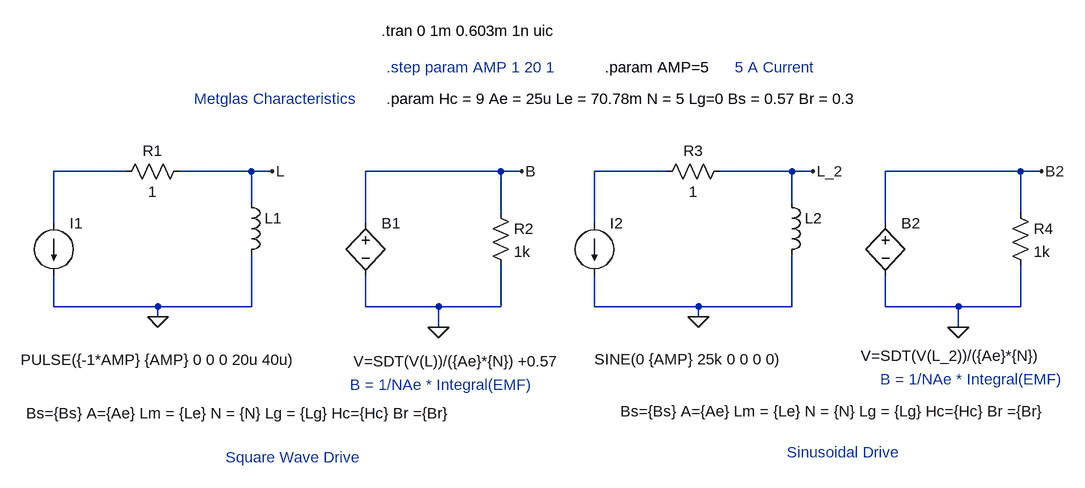
[diagram p0: schematic FULL_LTSPICE.asc]
FULL_LTSPICE.asc, the LTspice schematic file:
Version 4
SHEET 1 2340 832
WIRE 576 16 464 16
WIRE 768 16 656 16
WIRE 800 16 768 16
WIRE 1152 16 944 16
WIRE 1184 16 1152 16
WIRE 1408 16 1296 16
WIRE 1600 16 1488 16
WIRE 1632 16 1600 16
WIRE 1952 16 1744 16
WIRE 1984 16 1952 16
WIRE 768 64 768 16
WIRE 1600 64 1600 16
WIRE 1152 80 1152 16
WIRE 1952 80 1952 16
WIRE 464 96 464 16
WIRE 944 96 944 16
WIRE 1296 96 1296 16
WIRE 1744 96 1744 16
WIRE 464 224 464 176
WIRE 624 224 464 224
WIRE 768 224 768 144
WIRE 768 224 624 224
WIRE 944 224 944 176
WIRE 1056 224 944 224
WIRE 1152 224 1152 160
WIRE 1152 224 1056 224
WIRE 1296 224 1296 176
WIRE 1456 224 1296 224
WIRE 1600 224 1600 144
WIRE 1600 224 1456 224
WIRE 1744 224 1744 176
WIRE 1856 224 1744 224
WIRE 1952 224 1952 160
WIRE 1952 224 1856 224
WIRE 624 240 624 224
WIRE 1456 240 1456 224
WIRE 1056 256 1056 224
WIRE 1856 256 1856 224
FLAG 624 240 0
FLAG 800 16 L
FLAG 1056 256 0
FLAG 1184 16 B
FLAG 1456 240 0
FLAG 1632 16 L_2
FLAG 1856 256 0
FLAG 1984 16 B2
SYMBOL ind 752 48 R0
WINDOW 3 -331 340 Left 2
SYMATTR Value Bs={Bs} A={Ae} Lm = {Le} N = {N} Lg = {Lg} Hc={Hc} Br ={Br}
SYMATTR InstName L1
SYMBOL current 464 96 R0
WINDOW 3 -51 210 Left 2
WINDOW 123 0 0 Left 0
WINDOW 39 0 0 Left 0
SYMATTR Value PULSE({-1*AMP} {AMP} 0 0 0 20u 40u)
SYMATTR InstName I1
SYMBOL res 672 0 R90
WINDOW 0 0 56 VBottom 2
WINDOW 3 32 56 VTop 2
SYMATTR InstName R1
SYMATTR Value 1
SYMBOL bv 944 80 R0
WINDOW 3 -19 228 Left 2
SYMATTR Value V=SDT(V(L))/({Ae}*{N}) +0.57
SYMATTR InstName B1
SYMBOL res 1136 64 R0
SYMATTR InstName R2
SYMATTR Value 1k
SYMBOL ind 1584 48 R0
WINDOW 3 -248 337 Left 2
SYMATTR Value Bs={Bs} A={Ae} Lm = {Le} N = {N} Lg = {Lg} Hc={Hc} Br ={Br}
SYMATTR InstName L2
SYMBOL current 1296 96 R0
WINDOW 3 0 209 Left 2
WINDOW 123 0 0 Left 0
WINDOW 39 0 0 Left 0
SYMATTR Value SINE(0 {AMP} 25k 0 0 0 0)
SYMATTR InstName I2
SYMBOL res 1504 0 R90
WINDOW 0 0 56 VBottom 2
WINDOW 3 32 56 VTop 2
SYMATTR InstName R3
SYMATTR Value 1
SYMBOL bv 1744 80 R0
WINDOW 3 -38 220 Left 2
SYMATTR Value V=SDT(V(L_2))/({Ae}*{N})
SYMATTR InstName B2
SYMBOL res 1936 64 R0
SYMATTR InstName R4
SYMATTR Value 1k
TEXT 976 -96 Left 2 !.param Hc = 9 Ae = 25u Le = 70.78m N = 5 Lg=0 Bs = 0.57 Br = 0.3
TEXT 968 -200 Left 2 !.tran 0 1m 0.603m 1n uic
TEXT 976 -144 Left 2 ;.step param AMP 1 20 1
TEXT 1312 -144 Left 2 !.param AMP=5
TEXT 1592 448 Left 2 ;Sinusoidal Drive
TEXT 728 456 Left 2 ;Square Wave Drive
TEXT 1736 336 Left 2 ;B = 1/NAe * Integral(EMF)
TEXT 680 -96 Left 2 ;Metglas Characteristics
TEXT 1512 -144 Left 2 ;5 A Current
TEXT 920 344 Left 2 ;B = 1/NAe * Integral(EMF)

The netlist it stands for:
* FULL_LTSPICE.asc
L1 L 0 Bs={Bs} A={Ae} Lm = {Le} N = {N} Lg = {Lg} Hc={Hc} Br ={Br}
I1 N001 0 PULSE({-1*AMP} {AMP} 0 0 0 20u 40u)
R1 L N001 1
B1 B 0 V=SDT(V(L))/({Ae}*{N}) +0.57
R2 B 0 1k
L2 L_2 0 Bs={Bs} A={Ae} Lm = {Le} N = {N} Lg = {Lg} Hc={Hc} Br ={Br}
I2 N002 0 SINE(0 {AMP} 25k 0 0 0 0)
R3 L_2 N002 1
B2 B2 0 V=SDT(V(L_2))/({Ae}*{N})
R4 B2 0 1k
.param Hc = 9 Ae = 25u Le = 70.78m N = 5 Lg=0 Bs = 0.57 Br = 0.3
.tran 0 1m 0.603m 1n uic
* .step param AMP 1 20 1
.param AMP=5
* Sinusoidal Drive
* Square Wave Drive
* B = 1/NAe * Integral(EMF)
* Metglas Characteristics
* 5 A Current
* B = 1/NAe * Integral(EMF)
.backanno
.end